# Altium schematic sheet E-21 Neopixel Blaster.SchDoc: Neopixel Blaster
size B; DrawnBy: Jeremie Boulianne; Organization: Synthiam Inc.; Address1: Unit 10, 6120 - 11 St. SE; Address2: Calgary, AB; Address3: T2H 2L7; Address4: Canada; Revision: 0
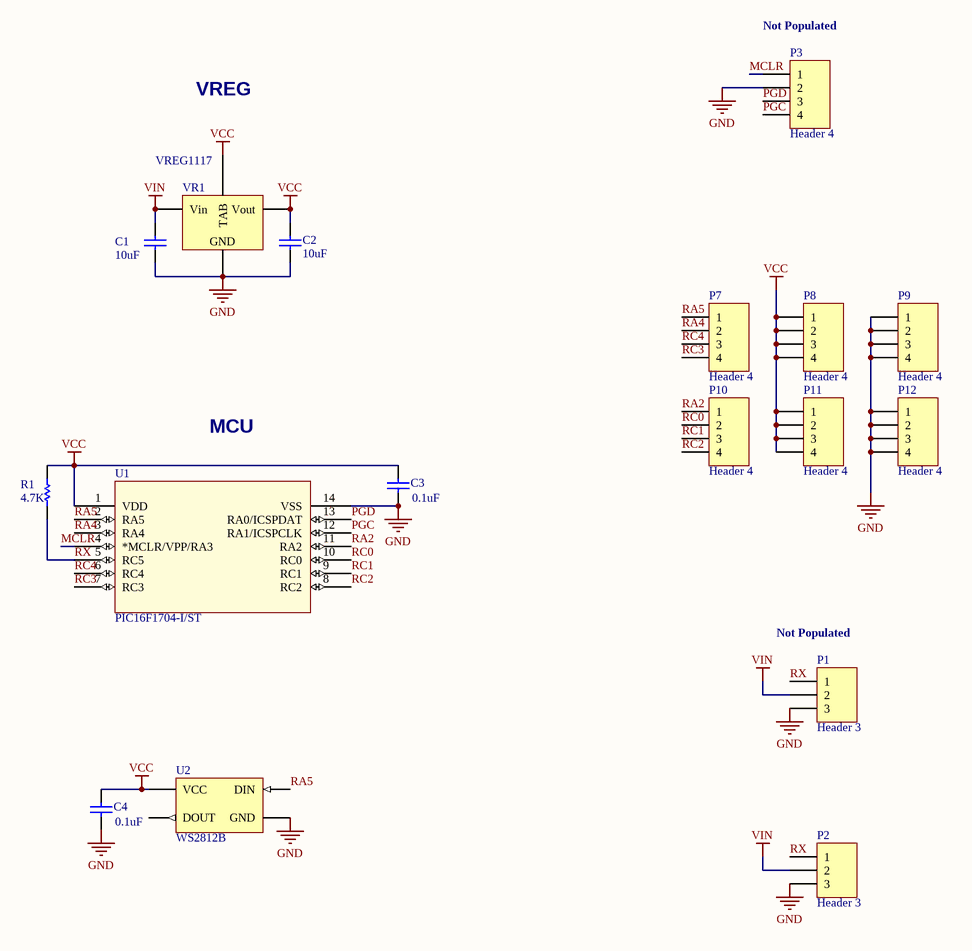
[diagram p0: E-21 Neopixel Blaster.SchDoc]

## Parts
C1  value 10uF  [0805]  (hidden comment: Cap)
C2  value 10uF  [0805]  (hidden comment: Cap)
C3  value 0.1uF  [0805 TIGHT]  (hidden comment: 18pF)
C4  value 0.1uF  [0805 TIGHT]  (hidden comment: 18pF)
P1  Header 3  [HDR1X3]
P2  Header 3  [JST-PH 3-PIN]
P3  Header 4  [MINI PROG4]
P7  Header 4  [HDR1X4]
P8  Header 4  [HDR1X4]
P9  Header 4  [HDR1X4]
P10  Header 4  [HDR1X4]
P11  Header 4  [HDR1X4]
P12  Header 4  [HDR1X4]
R1  value 4.7K  [0805 TIGHT]  (hidden comment: Res1)
U1  PIC16F1704-I/ST  [TSSOP14]
U2  WS2812B  [ws2812b]
VR1  VREG1117  [VREG1117]

## Nets
GND: C1.2 C2.2 C3.1 C4.1 P1.3 P2.3 P3.2 P9.1 P9.2 P9.3 P9.4 P12.1 P12.2 P12.3 P12.4 U1.14(VSS) U2.3(GND) VR1.1(GND)
VCC: C2.1 C3.2 C4.2 P8.1 P8.2 P8.3 P8.4 P11.1 P11.2 P11.3 P11.4 R1.2 U1.1(VDD) U2.1(VCC) VR1.2(Vout)
VIN: C1.1 P1.2 P2.2 VR1.3(Vin)
MCLR: P3.1 U1.4(*MCLR/VPP/RA3)
PGC: P3.4 U1.12(RA1/ICSPCLK)
PGD: P3.3 U1.13(RA0/ICSPDAT)
RA2: P10.1 U1.11(RA2)
RA4: P7.2 U1.3(RA4)
RA5: P7.1 U1.2(RA5) U2.4(DIN)
RC0: P10.2 U1.10(RC0)
RC1: P10.3 U1.9(RC1)
RC2: P10.4 U1.8(RC2)
RC3: P7.4 U1.7(RC3)
RC4: P7.3 U1.6(RC4)
RX: P1.1 P2.1 R1.1 U1.5(RC5)

Not connected (* = marked no-connect by the designer): U2 2(DOUT)

## Notes on the sheet
- (near P3) Not Populated
- VREG
- MCU
- (near P1) Not Populated
- Property of:
- Size:
- Date:
- B
- Drawn By:
- Time:
- Revision:
- Copyright © 2019 Synthiam Inc. All rights reserved.

## Library data of the parts
C1-C4 = Cap: Capacitor; Published: 8-Jun-2000; LatestRevisionDate: 17-Jul-2002; LatestRevisionNote: Re-released for DXP Platform.; PackageReference: RAD-0.3; Publisher: Altium Limited
P1 P2 = Header 3: Header, 3-Pin; LatestRevisionDate: 17-Jul-2002; LatestRevisionNote: Re-released for DXP Platform.; Publisher: Altium Limited
P3 P7-P12 = Header 4: Header, 4-Pin; LatestRevisionDate: 17-Jul-2002; LatestRevisionNote: Re-released for DXP Platform.; Publisher: Altium Limited
R1 = Res1: Resistor; Published: 8-Jun-2000; LatestRevisionDate: 17-Jul-2002; LatestRevisionNote: Re-released for DXP Platform.; PackageReference: AXIAL-0.3; Publisher: Altium Limited
U1 = PIC16F1503